# Altium project Master_HV_PCB.PrjPcb (part 2 of 2)

## Sheet [5]Current_Sensor.SchDoc
size A4; SheetNumber: 7; SheetTotal: 7
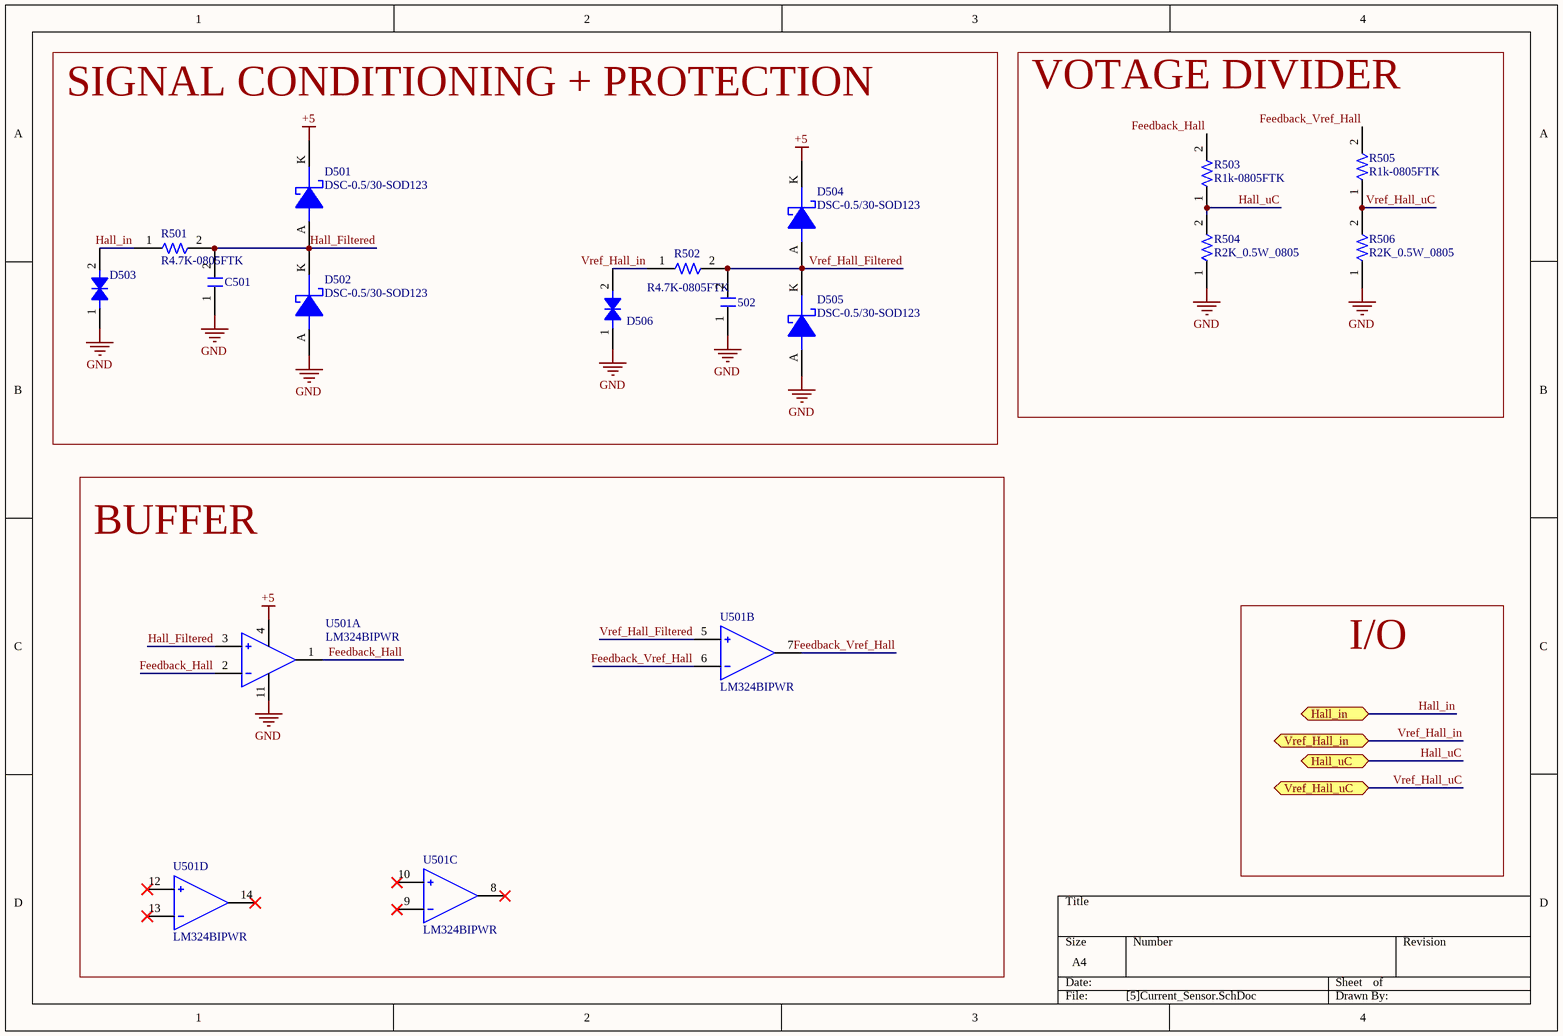
[diagram p5: [5]Current_Sensor.SchDoc]

### Parts
502  C10n-50V-0805FNPC-X7R  [C0805FNPC-R]  (value not drawn)
C501  C10n-50V-0805FNPC-X7R  [C0805FNPC-R]  (value not drawn)
D501  DSC-0.5/30-SOD123  [DSC-SOD123]
D502  DSC-0.5/30-SOD123  [DSC-SOD123]
D503  DTVS-6V-DO-214AC  [DTVS-DO-214AC]  (value not drawn)
D504  DSC-0.5/30-SOD123  [DSC-SOD123]
D505  DSC-0.5/30-SOD123  [DSC-SOD123]
D506  DTVS-6V-DO-214AC  [DTVS-DO-214AC]  (value not drawn)
R501  R4.7K-0805FTK  [R0805FTK]
R502  R4.7K-0805FTK  [R0805FTK]
R503  R1k-0805FTK  [R0805FTK]
R504  R2K_0.5W_0805  [0805]
R505  R1k-0805FTK  [R0805FTK]
R506  R2K_0.5W_0805  [0805]
U501  LM324BIPWR  [FP-PW0014A-IPC_B]  (parts A,B,C,D of 4)

### Blocks framed on the sheet
SIGNAL CONDITIONING + PROTECTION: 502 C501 D501-D506 R501 R502
VOTAGE DIVIDER: R503-R506
BUFFER: U501

### Ports
Hall_in (bidir, see Master_HV_PCB[2A]), Hall_uC (bidir, see Master_HV_PCB[2A]), Vref_Hall_in (bidir, see Master_HV_PCB[2A]), Vref_Hall_uC (bidir, see Master_HV_PCB[2A])

### Nets
+5: D501.K D504.K U501.4(VCC+)
GND: 502.1 C501.1 D502.A D503.1 D505.A D506.1 R504.1 R506.1 U501.11(VCC-)
Feedback_Hall: R503.2 U501.1(1OUT) U501.2(1IN-)
Feedback_Vref_Hall: R505.2 U501.6(2IN-) U501.7(2OUT)
Hall_Filtered: C501.2 D501.A D502.K R501.2 U501.3(1IN+)
Hall_in: D503.2 R501.1 ; port Hall_in
Hall_uC: R503.1 R504.2 ; port Hall_uC
Vref_Hall_Filtered: 502.2 D504.A D505.K R502.2 U501.5(2IN+)
Vref_Hall_in: D506.2 R502.1 ; port Vref_Hall_in
Vref_Hall_uC: R505.1 R506.2 ; port Vref_Hall_uC

Not connected (* = marked no-connect by the designer): U501 8(3OUT)* 9(3IN-)* 10(3IN+)* 12(4IN+)* 13(4IN-)* 14(4OUT)*

### Notes on the sheet
- I/O

### Library data of the parts
502 C501 = CMP-00053-1: Cap, 0.01ΜF, 50V, 10%, X7R, 0805; Manufacturer Part Number 1: 885012207092; Manufacturer 1: Wurth Electronics; .Creator: DR; Value: 10nF; ComponentLink4URL: https://katalog.we-online.de/pbs/datasheet/885012207092.pdf?src-supplier=Digi-Key; Width: 0.049inch; ComponentLink1URL: http://www.farnell.com/datasheets/1958497.pdf?src-supplier=Farnell; Max Operating Temperature: 125°C; Packaging: Cut Tape; Mount: Surface Mount; ComponentLink2Description: http://www.farnell.com/datasheets/1958497.pdf?src-supplier=Element14; Voltage Rating: 50V; Source: Passives.SchLib; Design Item ID: C10n-50V-0805FNPC-X7R; ComponentLink4Description: https://katalog.we-online.de/pbs/datasheet/885012207092.pdf?src-supplier=Digi-Key; Stock 1: 1; Tolerance: 10%; REACH SVHC: Unknown; ComponentLink2URL: http://www.farnell.com/datasheets/1958497.pdf?src-supplier=Element14; ComponentLink1Description: http://www.farnell.com/datasheets/1958497.pdf?src-supplier=Farnell; RoHS: Yes; Min Operating Temperature: -55°C; Voltage Rating (DC): 50V; Dielectric: X7R; ComponentLink3URL: http://www.farnell.com/datasheets/1958497.pdf?src-supplier=Newark; Category: Ceramic Capacitors; ComponentLink3Description: http://www.farnell.com/datasheets/1958497.pdf?src-supplier=Newark; Case/Package: 0805; Pricing 1: 4000=0,03200, 12000=0,03100 (USD); Length: 0.079inch; RoHS Compliant: Yes; Case Code (Metric): 2012; Thickness: 0.035inch
D501 D502 D504 D505 = CMP-00165-1: VR=30V IF=500mA 30pF P=410mW; Max Reverse Leakage Current: 130uA; .Creator: GP; Max Reverse Voltage (DC): 30V; Element Configuration: Single; Average Rectified Current: 500mA; Peak Non-Repetitive Surge Current: 5.5A; Polarity: Standard; Forward Voltage: 430mV; ComponentLink10Description: https://datasheet.ciiva.com/910/mbr0530-910518.pdf?src-supplier=Digi-Key; ComponentLink1Description: Datasheet; Category: Diode; ComponentLink3Description: https://datasheet.ciiva.com/30479/0900766b810e2512-30479401.pdf?src-supplier=RSComponents; ComponentLink5Description: https://datasheet.ciiva.com/910/mbr0530-910516.pdf?src-supplier=Digi-Key; Stock 1: 9; Weight: 0.03g; Source: Filter components.SchLib; ComponentLink2Description: Where buy it; Series: -; Mount: Surface Mount; Max Repetitive Reverse Voltage (Vrrm): 30V; Pricing 1: 1=0,34400, 10=0,23900, 100=0,12200, 500=0,10000 (USD); Design Item ID: DSC-0.5/30-SOD123; ComponentLink8Description: https://datasheet.ciiva.com/17318/mbr0530-17318568.pdf?src-supplier=Future+Electronics; Current Rating: 500mA; ComponentLink1URL: *; Length: 2.7mm; Max Reverse Current: 130uA; ComponentLink7URL: https://datasheet.ciiva.com/8300/mbr0530-8300905.pdf?src-supplier=Avnet; ComponentLink9URL: https://datasheet.ciiva.com/15144/getdatasheetpartid-86760-15144598.pdf?src-supplier=Verical; Radiation Hardening: No; Height: 1.03mm; ComponentLink4Description: https://datasheet.ciiva.com/34301/974753-34301826.pdf?src-supplier=Jameco; ComponentLink7Description: https://datasheet.ciiva.com/8300/mbr0530-8300905.pdf?src-supplier=Avnet; Package Quantity: 1; Forward Current: 500mA; ComponentLink5URL: https://datasheet.ciiva.com/910/mbr0530-910516.pdf?src-supplier=Digi-Key; Max Surge Current: 5.5A; Lead Free: Lead Free; ComponentLink2URL: *; Max Forward Surge Current (Ifsm): 5.5A; Output Current: 500mA; Voltage Rating (DC): 30V; Contact Plating: Tin,Matte; RoHS Compliant: Yes; REACH SVHC: No SVHC; ComponentLink10URL: https://datasheet.ciiva.com/910/mbr0530-910518.pdf?src-supplier=Digi-Key; ComponentLink4URL: https://datasheet.ciiva.com/34301/974753-34301826.pdf?src-supplier=Jameco; ComponentLink6URL: https://datasheet.ciiva.com/25931/mbr0530-25931989.pdf?src-supplier=Avnet+Europe; ComponentLink6Description: https://datasheet.ciiva.com/25931/mbr0530-25931989.pdf?src-supplier=Avnet+Europe; Width: 1.6mm; ComponentLink3URL: https://datasheet.ciiva.com/30479/0900766b810e2512-30479401.pdf?src-supplier=RSComponents; ComponentLink9Description: https://datasheet.ciiva.com/15144/getdatasheetpartid-86760-15144598.pdf?src-supplier=Verical; ComponentLink8URL: https://datasheet.ciiva.com/17318/mbr0530-17318568.pdf?src-supplier=Future+Electronics
D503 D506 = CMP-00154-1: TVS diode [Würth Elektronik] 824501600 TVS diode; Manufacturer: Wurth Electronics; Power Line Protection: No; Forward Voltage: 7.02V; Number of Bidirectional Channels: 1; Peak Pulse Current: 38.8A; Reverse Standoff Voltage: 6V; .Creator: DO; Polarity: Bidirectional; Peak Pulse Power: 400W; Clamping Voltage: 10.3V; ComponentLink2Description: http://www.farnell.com/datasheets/2036401.pdf?src-supplier=Element14; Source: Filter components.SchLib; ComponentLink3URL: https://katalog.we-online.de/pbs/datasheet/824501600.pdf?src-supplier=Digi-Key; Mount: Surface Mount; Design Item ID: DTVS-6V-DO-214AC; ComponentLink3Description: https://katalog.we-online.de/pbs/datasheet/824501600.pdf?src-supplier=Digi-Key; RoHS: Yes; Resistor Type: Zener; REACH SVHC: Unknown; Pins: 2; Min Breakdown Voltage: 7.02V; Min Operating Temperature: -65°C; ComponentLink1URL: https://www.we-online.com/catalog/en/WE-TVSP?sq=824501600#824501600; Stock 1: 780; Pricing 1: 1=0,28000, 10=0,26100, 50=0,26100, 100=0,23400, 500=0,20400, 1000=0,17400, 10000=0,17400 (USD); ComponentLink2URL: http://www.farnell.com/datasheets/2036401.pdf?src-supplier=Element14; Category: TVS Diodes; ComponentLink1Description: Where buy it; Manufacturer Part Number: 824501600; Packaging: Cut Tape; RoHS Compliant: Yes; Max Operating Temperature: 150°C
R501 R502 = CMP-00102-1: Res Thick Film 0805 4.7K Ohm 5% 1/8W ±200ppm/°C Molded SMD SMD Paper Tape on Plastic Reel; Manufacturer Part Number 1: CR0805-JW-472ELF; Manufacturer 1: Bourns; Max Power Dissipation: 125mW; .Creator: DR; Voltage Rating (DC): 150V; ComponentLink5URL: https://datasheet.ciiva.com/9122/chpreztr-9122814.pdf?src-supplier=Avnet; ComponentLink2URL: https://datasheet.ciiva.com/6560/chpreztr-6560073.pdf?src-supplier=Digi-Key; Depth: 1.25mm; ComponentLink7URL: https://datasheet.ciiva.com/6560/chpreztr-6560075.pdf?src-supplier=Digi-Key; Radiation Hardening: No; ComponentLink5Description: https://datasheet.ciiva.com/9122/chpreztr-9122814.pdf?src-supplier=Avnet; Construction: Rectangular; Case/Package: 0805; Design Item ID: R4.7K-0805FTK; RoHS Compliant: Yes; Min Operating Temperature: -55°C; Height: 0.024inch; ComponentLink1Description: https://datasheet.ciiva.com/5541/chpreztr-5541593.pdf?src-supplier=Mouser; Series: CR0805; Packaging: Tape and Reel; Width: 0.049inch; Stock 1: 3734; ComponentLink3URL: https://datasheet.ciiva.com/6560/chpreztr-6560074.pdf?src-supplier=Digi-Key; ComponentLink4URL: https://datasheet.ciiva.com/30174/159chpreztr-30174252.pdf?src-supplier=Onlinecomponents.com; Value: 4.7k; Military Standard: Not; Tolerance: 5%; Voltage Rating: 150V; ComponentLink6Description: https://datasheet.ciiva.com/22713/691949-22713272.pdf?src-supplier=Element14; REACH SVHC: No SVHC; Package Quantity: 1; Termination: SMD/SMT; ComponentLink1URL: https://datasheet.ciiva.com/5541/chpreztr-5541593.pdf?src-supplier=Mouser; ComponentLink4Description: https://datasheet.ciiva.com/30174/159chpreztr-30174252.pdf?src-supplier=Onlinecomponents.com; Resistor Type: Thick Film; Length: 2mm; Case Code (Metric): 2012; Category: Chip SMD Resistors; Resistance Tolerance: 5%; Thickness: 508um; ComponentLink6URL: https://datasheet.ciiva.com/22713/691949-22713272.pdf?src-supplier=Element14; Features: Moisture Resistant; Power Rating: 125mW; RoHS: Yes; Mount: Surface Mount; ComponentLink7Description: https://datasheet.ciiva.com/6560/chpreztr-6560075.pdf?src-supplier=Digi-Key; Number of Terminations: 2; Source: Passives.SchLib; Temperature Coefficient: 200ppm/°C; Max Operating Temperature: 155°C; ComponentLink3Description: https://datasheet.ciiva.com/6560/chpreztr-6560074.pdf?src-supplier=Digi-Key; ComponentLink2Description: https://datasheet.ciiva.com/6560/chpreztr-6560073.pdf?src-supplier=Digi-Key; Pricing 1: 1=0,05590, 10=0,01670, 25=0,01290, 100=0,00840, 250=0,00830, 500=0,00690, 1000=0,00410 (USD); Contact Plating: Tin
R503 R505 = CMP-00076-1: Res Thick Film 0805 1K Ohm 5% 1/8W ±200ppm/°C Molded SMD SMD Paper Tape on Plastic Reel; Manufacturer Part Number 1: CR0805-JW-102ELF; Manufacturer 1: Bourns; Voltage Rating (DC): 150V; Power Rating: 125mW; .Creator: GP; Number of Terminations: 2; REACH SVHC: No SVHC; ComponentLink3URL: https://datasheet.ciiva.com/22693/1902866-22693253.pdf?src-supplier=Element14; ComponentLink1URL: https://datasheet.ciiva.com/11821/0900766b80fcdb72-11821134.pdf?src-supplier=RSComponents; ComponentLink1Description: https://datasheet.ciiva.com/11821/0900766b80fcdb72-11821134.pdf?src-supplier=RSComponents; Category: Chip SMD Resistors; Stock 1: 27510; Case/Package: 0805; ComponentLink3Description: https://datasheet.ciiva.com/22693/1902866-22693253.pdf?src-supplier=Element14; Length: 2mm; ComponentLink5URL: https://datasheet.ciiva.com/7985/1856384-7985867.pdf?src-supplier=Element14; ComponentLink7Description: https://datasheet.ciiva.com/6547/chpreztr-6547359.pdf?src-supplier=Digi-Key; Package Quantity: 1; Tolerance: 5%; Lead Free: Lead Free; RoHS: Yes; Contact Plating: Tin; ComponentLink2Description: https://datasheet.ciiva.com/15225/getdatasheetpartid-78155-15225381.pdf?src-supplier=Verical; ComponentLink5Description: https://datasheet.ciiva.com/7985/1856384-7985867.pdf?src-supplier=Element14; Depth: 1.25mm; Thickness: 508um; Resistor Type: Thick Film; Design Item ID: R1k-0805FTK; ComponentLink2URL: https://datasheet.ciiva.com/15225/getdatasheetpartid-78155-15225381.pdf?src-supplier=Verical; Max Operating Temperature: 155°C; ComponentLink6URL: https://datasheet.ciiva.com/30242/159chpreztr-30242765.pdf?src-supplier=Onlinecomponents.com; ComponentLink4URL: https://datasheet.ciiva.com/7986/1856384-7986184.pdf?src-supplier=Element14; Military Standard: Not; Case Code (Metric): 2012; Temperature Coefficient: 200ppm/°C; Pricing 1: 1=0,05930, 10=0,03510, 25=0,01790, 100=0,00800, 250=0,00790, 500=0,00590, 1000=0,00360, 3000=0,00350, 6000=0,00250 (USD); Min Operating Temperature: -55°C; ComponentLink7URL: https://datasheet.ciiva.com/6547/chpreztr-6547359.pdf?src-supplier=Digi-Key; Width: 1.25mm; Source: Passives.SchLib; Max Power Dissipation: 125mW; Voltage Rating: 150V; ComponentLink4Description: https://datasheet.ciiva.com/7986/1856384-7986184.pdf?src-supplier=Element14; Features: Moisture Resistant; Mount: Surface Mount; Termination: SMD/SMT; Value: 1k; Height: 0.5mm; Radiation Hardening: No; ComponentLink6Description: https://datasheet.ciiva.com/30242/159chpreztr-30242765.pdf?src-supplier=Onlinecomponents.com; Pins: 2; Packaging: Tape and Reel
R504 R506 = CMP-009-00027-1: Fixed Resistor, Metal Glaze/thick Film, 0.5W, 2000ohm, 150V, 1% +/-Tol, 100ppm/Cel, Surface Mount, 0805; Part Number: CRCW08052K00FKEAHP; Manufacturer: Vishay; Value: 2k; Power: 500mW; Max Operating Temperature: 155°C; Case/Package: 0805; Mounting Technology: Surface Mount; RoHS Compliant: Yes; Tolerance: 1%; Min Operating Temperature: -55°C; Pins: 2
U501 = CMP-014-00004-4: Quad, 36-V 1.2-MHz 3-mV offset voltage operational amplifier with -40°C to 85°C operation 14-TSSOP -40 to 85

## Sheet [3]HV_Detection.SchDoc
size A4; SheetNumber: 6; SheetTotal: 7
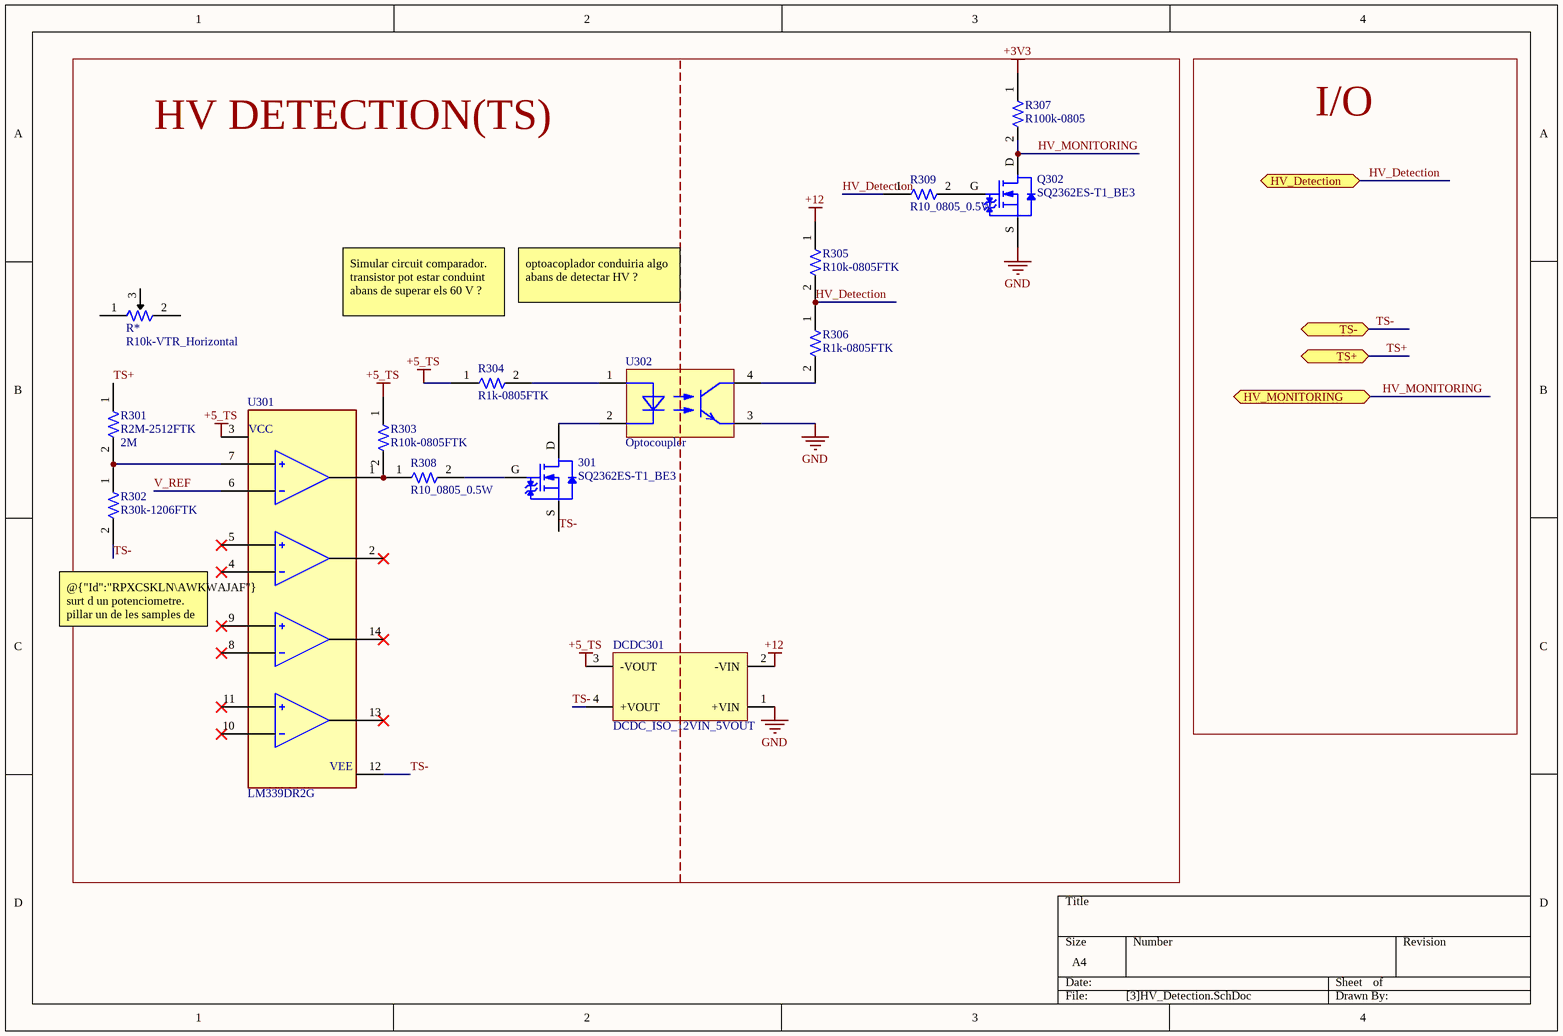
[diagram p6: [3]HV_Detection.SchDoc]

### Parts
301  SQ2362ES-T1_BE3  [SOT95P245X110-3N]
DCDC301  DCDC_ISO_12VIN_5VOUT  [WPME-FISM_SIP-7_L19.65W7.05H10.16]
Q302  SQ2362ES-T1_BE3  [SOT95P245X110-3N]
R301  R2M-2512FTK  Resistance: 2M  [R2512FTK]
R302  R30k-1206FTK  [R1206FTK-W]
R303  R10k-0805FTK  [R0805FTK]
R304  R1k-0805FTK  [R0805FTK]
R305  R10k-0805FTK  [R0805FTK]
R306  R1k-0805FTK  [R0805FTK]
R307  R100k-0805  [RESC2013X70X40NL20T20]
R308  R10_0805_0.5W  [0805]
R309  R10_0805_0.5W  [0805]
R*  R10k-VTR_Horizontal  [T93Z103KT20]
U301  LM339DR2G  [ONSC-SOIC-14-751A-03_V]
U302  Optocoupler  [WL-OCPT_LSOP4]

### Blocks framed on the sheet
HV DETECTION(TS): 301 DCDC301 Q302 R301-R309 R* U301 U302

### Ports
HV_Detection (bidir, see Master_HV_PCB[1C], [2]TSAL[4B]), HV_MONITORING (bidir, see Master_HV_PCB[1C]), TS+ (bidir, see Master_HV_PCB[2C], [2]TSAL[4C], [6]Accumulator_Indicator[3A]), TS- (bidir, see Master_HV_PCB[2C], [2]TSAL[4C], [6]Accumulator_Indicator[3A])

### Nets
+3V3: R307.1
+5_TS: DCDC301.3(-VOUT) R303.1 R304.1 U301.3(VCC+)
+12: DCDC301.2(-VIN) R305.1
GND: DCDC301.1(+VIN) Q302.S U302.3(Emitter)
HV_Detection: R305.2 R306.1 R309.1 ; port HV_Detection
HV_MONITORING: Q302.D R307.2 ; port HV_MONITORING
TS+: R301.1 ; port TS+
TS-: 301.S DCDC301.4(+VOUT) R302.2 U301.12(VEE) ; port TS-
V_REF: U301.6(1IN-)
Net301_D: 301.D U302.2(Cathode)
Net301_G: 301.G R308.2
NetQ302_G: Q302.G R309.2
NetR301_2: R301.2 R302.1 U301.7(1IN+)
NetR303_2: R303.2 R308.1 U301.1(1OUT)
NetR304_2: R304.2 U302.1(Anode)
NetR306_2: R306.2 U302.4(Collector)

Not connected (* = marked no-connect by the designer): R* 1(2) 2 3; U301 2(2OUT)* 4(2IN-)* 5(2IN+)* 8(3IN-)* 9(3IN+)* 10(4IN-)* 11(4IN+)* 13(13OUT)* 14(14OUT)*

### Notes on the sheet
- I/O
- Simular circuit comparador. transistor pot estar conduint abans de superar els 60 V ?
- optoacoplador conduiria algo abans de detectar HV ?
- @{"Id":"RPXCSKLN\AWKWAJAF"} surt d un potenciometre. pillar un de les samples de vishay
- (in symbol CMP-014-00005-4) VCC

### Library data of the parts
301 Q302 = CMP-013-00001-1: Small Signal Field-Effect Transistor; RoHS Compliant: Yes
DCDC301 = CMP-019-00001-1: WPME-FISM Fixed Isolated SIP/SMT Module
R301 = CMP-00108-1: Current Sense Resistors - SMD 3watts .002ohms 1%; Manufacturer: Vishay Dale; Manufacturer Part Number: WSLP25122L000FEA; Power Rating: 3W; Temperature Coefficient: 275ppm/°C; Packaging: Tape and Reel; Height: 0.635mm; Weight: 0.001429oz; Case Code (Imperial): 2512; Source: Passives.SchLib; Tolerance: 1%; Termination: SMD/SMT; RoHS: Yes; Size Code: 2512; Case Code (Metric): 6432; Stock 1: 11994; ComponentLink1URL: https://datasheet.ciiva.com/48527/wslp-48527354.pdf?src-supplier=Avnet; Package Quantity: 2000; Length: 6.4mm; Resistor Type: Metal Strip; ComponentLink1Description: https://datasheet.ciiva.com/48527/wslp-48527354.pdf?src-supplier=Avnet; Design Item ID: R2M-2512FTK; Mount: Surface Mount; Width: 3.2mm; Category: Chip SMD Resistors; RoHS Compliant: Yes; Case/Package: 2512; Max Operating Temperature: 170°C; Lead Free: Lead Free; Pricing 1: 1=1,07000, 10=1,07000, 50=1,07000, 100=1,07000, 1000=0,77100, 10000=0,75500 (USD); Series: WSLP; Min Operating Temperature: -65°C
R302 = CMP-00092-1: Res Thick Film 1206 30K Ohm 1% 1/4W ±100ppm/°C Molded SMD SMD Paper T/R; Manufacturer: Vishay; Manufacturer Part Number: CRCW120630K0FKEA; Max Power Dissipation: 250mW; Voltage Rating: 200V; .Creator: GP; Military Standard: Not; Min Operating Temperature: -55°C; Tolerance: 1%; Category: Resistor; Pins: 2; Resistor Type: Thick Film; Height: 0.55mm; Resistance Tolerance: 1%; ComponentLink2URL: https://es.rs-online.com/web/p/resistencias-de-montaje-en-superficie/6792039; Series: CRCW; ComponentLink1URL: https://docs.rs-online.com/bca8/A700000006404581.pdf; Termination: SMD/SMT; Radiation Hardening: No; Case/Package: 1206; Max Operating Temperature: 155°C; Case Code (Metric): 3216; RoHS: Yes; Power Rating: 250mW; Pricing 1: 50=0,12000, 500=0,11200, 1000=0,10400, 2000=0,09700, 4000=0,08900 (USD); Stock 1: 3550; ComponentLink2Description: Where buy it; Construction: Rectangular; Packaging: Tape and Reel; ComponentLink1Description: Datasheet; RoHS Compliant: Yes; Temperature Coefficient: 100ppm/°C; Size Code: 1206; Package Quantity: 10; Number of Terminations: 2; Value: 30k; REACH SVHC: Unknown; Technology: THICK FILM; Length: 3.2mm; Contact Plating: Tin; Depth: 1.6mm; Features: Automotive AEC-Q200; Source: Passives.SchLib; Design Item ID: R30k-1206FTK; Width: 1.6mm; Weight: 0.000353oz
R303 R305 = CMP-00085-1: BOURNS         CR0805-JW-103ELF            Surface Mount Chip Resistor, Thick Film, CR Series, 10 kohm, 125 mW,  5%, 150 V; .Creator: DR; Power Rating: 125mW; Voltage Rating (DC): 100V; Voltage Rating: 150V; Temperature Coefficient: 200ppm/°C; Value: 10k; ComponentLink6URL: https://datasheet.ciiva.com/16783/70154685-16783482.pdf?src-supplier=Allied+Electronics; Manufacturer 1: Bourns; Package Quantity: 1; ComponentLink10URL: https://datasheet.ciiva.com/7985/1856384-7985869.pdf?src-supplier=Element14; Technology: THICK FILM; Source: Passives.SchLib; RoHS Compliant: Yes; ComponentLink10Description: https://datasheet.ciiva.com/7985/1856384-7985869.pdf?src-supplier=Element14; ComponentLink1URL: https://datasheet.ciiva.com/11821/0900766b80fcdb72-11821135.pdf?src-supplier=RSComponents; ComponentLink7Description: https://datasheet.ciiva.com/5548/chpreztr-5548491.pdf?src-supplier=Mouser; Radiation Hardening: No; Design Item ID: R10k-0805FTK; ComponentLink4Description: https://datasheet.ciiva.com/7986/691949-7986187.pdf?src-supplier=Element14; Pins: 2; ComponentLink9URL: https://datasheet.ciiva.com/6559/chpreztr-6559901.pdf?src-supplier=Digi-Key; Resistor Type: Thick Film; ComponentLink4URL: https://datasheet.ciiva.com/7986/691949-7986187.pdf?src-supplier=Element14; Contact Plating: Tin; Case Code (Metric): 2012; Military Standard: Not; Depth: 1.25mm; Case/Package: 0805; Packaging: Tape and Reel; ComponentLink9Description: https://datasheet.ciiva.com/6559/chpreztr-6559901.pdf?src-supplier=Digi-Key; Construction: Rectangular; Pricing 1: 1=0,05790, 10=0,01540, 25=0,01340, 100=0,00340 (USD); ComponentLink7URL: https://datasheet.ciiva.com/5548/chpreztr-5548491.pdf?src-supplier=Mouser; Category: Chip SMD Resistors; Length: 2mm; Max Operating Temperature: 155°C; Resistance Tolerance: 5%; Manufacturer Part Number 1: CR0805-JW-103ELF; Height: 0.5mm; ComponentLink2URL: https://datasheet.ciiva.com/9122/chpreztr-9122374.pdf?src-supplier=Avnet; Thickness: 508um; Max Power Dissipation: 125mW; ComponentLink8Description: https://datasheet.ciiva.com/6559/chpreztr-6559900.pdf?src-supplier=Digi-Key; REACH SVHC: No SVHC; ComponentLink8URL: https://datasheet.ciiva.com/6559/chpreztr-6559900.pdf?src-supplier=Digi-Key; ComponentLink5URL: https://datasheet.ciiva.com/30065/159chpreztr-30065976.pdf?src-supplier=Onlinecomponents.com; Width: 1.25mm; ComponentLink11URL: https://datasheet.ciiva.com/48692/001055517-da-01-en-smd-wid-cr0805-jw-103elf-10k-ohm-1-8w-48692118.pdf?src-supplier=Conrad; ComponentLink3Description: https://datasheet.ciiva.com/22693/1902866-22693254.pdf?src-supplier=Element14; ComponentLink11Description: https://datasheet.ciiva.com/48692/001055517-da-01-en-smd-wid-cr0805-jw-103elf-10k-ohm-1-8w-48692118.pdf?src-supplier=Conrad; ComponentLink1Description: https://datasheet.ciiva.com/11821/0900766b80fcdb72-11821135.pdf?src-supplier=RSComponents; ComponentLink2Description: https://datasheet.ciiva.com/9122/chpreztr-9122374.pdf?src-supplier=Avnet; Stock 1: 57566; Min Operating Temperature: -55°C; Series: CR0805; Number of Terminations: 2; Termination: SMD/SMT; Tolerance: 5%; Mount: Surface Mount; ComponentLink6Description: https://datasheet.ciiva.com/16783/70154685-16783482.pdf?src-supplier=Allied+Electronics; ComponentLink5Description: https://datasheet.ciiva.com/30065/159chpreztr-30065976.pdf?src-supplier=Onlinecomponents.com; RoHS: Yes; Features: Moisture Resistant; ComponentLink3URL: https://datasheet.ciiva.com/22693/1902866-22693254.pdf?src-supplier=Element14
R304 R306 = CMP-00076-1: as R503 on sheet [5]Current_Sensor; Number of Terminations: 2; REACH SVHC: No SVHC; ComponentLink3URL: https://datasheet.ciiva.com/22693/1902866-22693253.pdf?src-supplier=Element14; ComponentLink1URL: https://datasheet.ciiva.com/11821/0900766b80fcdb72-11821134.pdf?src-supplier=RSComponents; ComponentLink1Description: https://datasheet.ciiva.com/11821/0900766b80fcdb72-11821134.pdf?src-supplier=RSComponents; Category: Chip SMD Resistors; Stock 1: 27510; Case/Package: 0805; ComponentLink3Description: https://datasheet.ciiva.com/22693/1902866-22693253.pdf?src-supplier=Element14; Length: 2mm; ComponentLink5URL: https://datasheet.ciiva.com/7985/1856384-7985867.pdf?src-supplier=Element14; ComponentLink7Description: https://datasheet.ciiva.com/6547/chpreztr-6547359.pdf?src-supplier=Digi-Key; Package Quantity: 1; Tolerance: 5%; Lead Free: Lead Free; RoHS: Yes; Contact Plating: Tin; ComponentLink2Description: https://datasheet.ciiva.com/15225/getdatasheetpartid-78155-15225381.pdf?src-supplier=Verical; ComponentLink5Description: https://datasheet.ciiva.com/7985/1856384-7985867.pdf?src-supplier=Element14; Depth: 1.25mm; Thickness: 508um; Resistor Type: Thick Film; Design Item ID: R1k-0805FTK; ComponentLink2URL: https://datasheet.ciiva.com/15225/getdatasheetpartid-78155-15225381.pdf?src-supplier=Verical; Max Operating Temperature: 155°C; ComponentLink6URL: https://datasheet.ciiva.com/30242/159chpreztr-30242765.pdf?src-supplier=Onlinecomponents.com; ComponentLink4URL: https://datasheet.ciiva.com/7986/1856384-7986184.pdf?src-supplier=Element14; Military Standard: Not; Case Code (Metric): 2012; Temperature Coefficient: 200ppm/°C; Pricing 1: 1=0,05930, 10=0,03510, 25=0,01790, 100=0,00800, 250=0,00790, 500=0,00590, 1000=0,00360, 3000=0,00350, 6000=0,00250 (USD); Min Operating Temperature: -55°C; ComponentLink7URL: https://datasheet.ciiva.com/6547/chpreztr-6547359.pdf?src-supplier=Digi-Key; Width: 1.25mm; Source: Passives.SchLib; Max Power Dissipation: 125mW; Voltage Rating: 150V; ComponentLink4Description: https://datasheet.ciiva.com/7986/1856384-7986184.pdf?src-supplier=Element14; Features: Moisture Resistant; Mount: Surface Mount; Termination: SMD/SMT; Value: 1k; Height: 0.5mm; Radiation Hardening: No; ComponentLink6Description: https://datasheet.ciiva.com/30242/159chpreztr-30242765.pdf?src-supplier=Onlinecomponents.com; Pins: 2; Packaging: Tape and Reel
R307 = CMP-009-00003-2: Fixed Resistor, Metal Glaze/thick Film, 0.125W, 100000ohm, 150V, 5% +/-Tol, 200ppm/Cel, Surface Mount, 0805; Value: 100k; Power: 125mW; Max Operating Temperature: 155°C; Mounting Technology: Surface Mount; RoHS Compliant: Yes; Min Operating Temperature: -55°C; Pins: 2; Case/Package: 0805; Tolerance: 5%
R308 R309 = CMP-009-00031-1: Fixed Resistor, Metal Glaze/thick Film, 0.5W, 10ohm, 150V, 1% +/-Tol, 100ppm/Cel, Surface Mount, 0805; Power: 500mW; Value: 10; Tolerance: 1%; Max Operating Temperature: 155°C; RoHS Compliant: Yes; Case/Package: 0805; Min Operating Temperature: -55°C; Mounting Technology: Surface Mount; Pins: 2
R* = CMP-009-00030-1: Trimmer, Cermet, 0.5W, 10000ohm, 10% +/-Tol, 21 Turn(s); Power: 500mW; Value: 10k; RoHS Compliant: Yes; Max Operating Temperature: 155°C; Pins: 3; Tolerance: 10%; Mounting Technology: Through Hole; Min Operating Temperature: -55°C
U301 = CMP-014-00005-4: Comparator, 4 Func, 9000uV Offset-Max, 1300ns Response Time, BIPolar, PDSO14; Nominal Supply Voltage: 5V; Channels: 4; Output Type: OPEN-COLLECTOR; Pins: 14; Case/Package: SOP; RoHS Compliant: Yes; Max Operating Temperature: 70°C; Min Operating Temperature: 0°C
U302 = CMP-00195-1: Transistor Output Optocoupler. S/N: 140100146000; RoHS Compliant: Yes

## Nets that join several sheets
+3V3: Master_HV_PCB (J2.16), [1]Shutdown (U101.16), [3]HV_Detection (R307.1)
+5: Master_HV_PCB (J1.8 J2.12 J7.1), [1]Shutdown (U101.1), [5]Current_Sensor (D501.K D504.K U501.4)
+12: Master_HV_PCB (6 pins), [1]Shutdown (X101.4 X102.4), [2]TSAL (R201.1 R203.1 R205.1 U201.14), [3]HV_Detection (DCDC301.2 R305.1)
GND: Master_HV_PCB (J2.18 J6.4 J6.5 J7.4), [4]Relays_Control (7 pins), [1]Shutdown (11 pins), [2]TSAL (13 pins), [5]Current_Sensor (9 pins), [3]HV_Detection (DCDC301.1 Q302.S U302.3)
AIR+_Aux: Master_HV_PCB (J9.3), [2]TSAL (D201.1 R207.1 R213.2)
AIR+_Coil: Master_HV_PCB (J1.10 J9.4), [4]Relays_Control (D401.A D404.1 Q401.D)
AIR+_Control: Master_HV_PCB (J2.2), [4]Relays_Control (R401.1)
AIR+_MONITORING: Master_HV_PCB (J2.11), [2]TSAL (R207.2 R208.2)
AIR+_State: Master_HV_PCB (J1.13), [2]TSAL (R201.2 R202.2 U201.3)
AIR-_Aux: Master_HV_PCB (J10.3), [2]TSAL (D202.1 R209.1 R215.2)
AIR-_Coil: Master_HV_PCB (J1.11 J10.4), [4]Relays_Control (D402.A D405.1 Q402.D)
AIR-_Control: Master_HV_PCB (J2.4), [4]Relays_Control (R402.1)
AIR-_MONITORING: Master_HV_PCB (J2.13), [2]TSAL (R209.2 R210.2)
AIR-_State: Master_HV_PCB (J1.14), [2]TSAL (R203.2 R204.2 U201.4)
BMS_OK: Master_HV_PCB (J2.19), [1]Shutdown (R109.1)
BMS_SC_MONITORING: Master_HV_PCB (J2.1), [1]Shutdown (U101.14)
Hall_in: Master_HV_PCB (J7.2), [5]Current_Sensor (D503.2 R501.1)
Hall_uC: Master_HV_PCB (J2.8), [5]Current_Sensor (R503.1 R504.2)
HV_Detection: Master_HV_PCB (J1.9), [2]TSAL (U201.2), [3]HV_Detection (R305.2 R306.1 R309.1)
HV_MONITORING: Master_HV_PCB (J2.17), [3]HV_Detection (Q302.D R307.2)
IMD_OK: Master_HV_PCB (J1.5 J6.2), [1]Shutdown (R107.2 R110.1)
IMD_OK_MONITORING: Master_HV_PCB (J2.5 J2.7), [1]Shutdown (U101.11)
IMD_SC_MONITORING: Master_HV_PCB (J2.3), [1]Shutdown (U101.13)
LED+: Master_HV_PCB (J3.1), [6]Accumulator_Indicator (5 pins)
LED-: Master_HV_PCB (J3.2), [6]Accumulator_Indicator (Q601.D)
Precharge_Aux: Master_HV_PCB (J11.3), [2]TSAL (D203.1 R211.1 R217.2)
Precharge_Coil: Master_HV_PCB (J1.12 J11.4), [4]Relays_Control (D403.A D406.1 Q403.D)
Precharge_Control: Master_HV_PCB (J2.6), [4]Relays_Control (R403.1)
Precharge_MONITORING: Master_HV_PCB (J2.15), [2]TSAL (R211.2 R212.2)
Precharge_State: Master_HV_PCB (J1.15), [2]TSAL (R205.2 R206.2 U201.5)
RESET_BUTTON: Master_HV_PCB (J1.6), [1]Shutdown (6 pins)
SC_END: Master_HV_PCB (6 pins), [4]Relays_Control (D401.K D402.K D403.K D407.1), [1]Shutdown (R105.2)
SC_END_MONITORING: Master_HV_PCB (J2.9), [1]Shutdown (U101.12)
SC_IMD-TSMP: Master_HV_PCB (J1.2), [1]Shutdown (R103.2 X102.6)
SC_SC-BMS: Master_HV_PCB (J1.1), [1]Shutdown (X101.5)
TS+: Master_HV_PCB (J5.1 J5.2), [6]Accumulator_Indicator (7 pins), [3]HV_Detection (R301.1)
TS+_Fused: Master_HV_PCB (J8.1 J8.2), [6]Accumulator_Indicator (F*.2)
TS-: Master_HV_PCB (J4.1 J4.2), [6]Accumulator_Indicator (D603.A Q601.S), [3]HV_Detection (301.S DCDC301.4 R302.2 U301.12)
TS_OFF: Master_HV_PCB (J1.4), [2]TSAL (U201.1)
Vref_Hall_in: Master_HV_PCB (J7.3), [5]Current_Sensor (D506.2 R502.1)
Vref_Hall_uC: Master_HV_PCB (J2.10), [5]Current_Sensor (R505.1 R506.2)